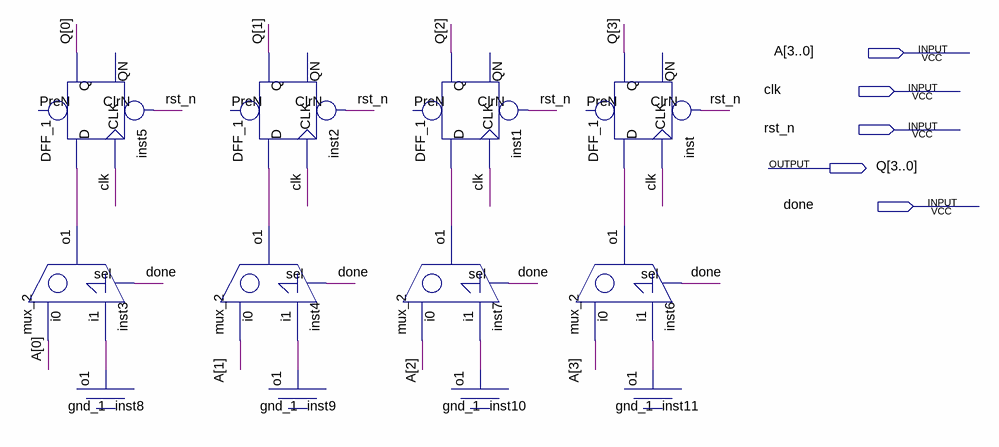
[diagram p0: schematic sheet]
// Quartus schematic DataReg.bdf as structural Verilog: 12 symbols, 5 pins
module DataReg (
  input  [3:0] A,
  input  clk,
  input  rst_n,
  input  done,
  output [3:0] Q
);

  wire inst3_o1, inst4_o1, inst6_o1, inst7_o1, inst8_o1, inst9_o1, inst10_o1, inst11_o1;

  DFF_1 inst5 (.CLK(clk), .D(inst3_o1), .ClrN(rst_n), .Q(Q[0]));  // open: PreN, QN
  mux_2 inst3 (.sel(done), .i0(A[0]), .i1(inst8_o1), .o1(inst3_o1));
  gnd_1 inst8 (.o1(inst8_o1));
  mux_2 inst4 (.sel(done), .i0(A[1]), .i1(inst9_o1), .o1(inst4_o1));
  DFF_1 inst2 (.CLK(clk), .D(inst4_o1), .ClrN(rst_n), .Q(Q[1]));  // open: PreN, QN
  gnd_1 inst9 (.o1(inst9_o1));
  DFF_1 inst1 (.CLK(clk), .D(inst7_o1), .ClrN(rst_n), .Q(Q[2]));  // open: PreN, QN
  mux_2 inst7 (.sel(done), .i0(A[2]), .i1(inst10_o1), .o1(inst7_o1));
  gnd_1 inst10 (.o1(inst10_o1));
  DFF_1 inst (.CLK(clk), .D(inst6_o1), .ClrN(rst_n), .Q(Q[3]));  // open: PreN, QN
  mux_2 inst6 (.sel(done), .i0(A[3]), .i1(inst11_o1), .o1(inst6_o1));
  gnd_1 inst11 (.o1(inst11_o1));
endmodule
